# EAGLE design tiny85Digispark0805 (EAGLE 9.5.0)
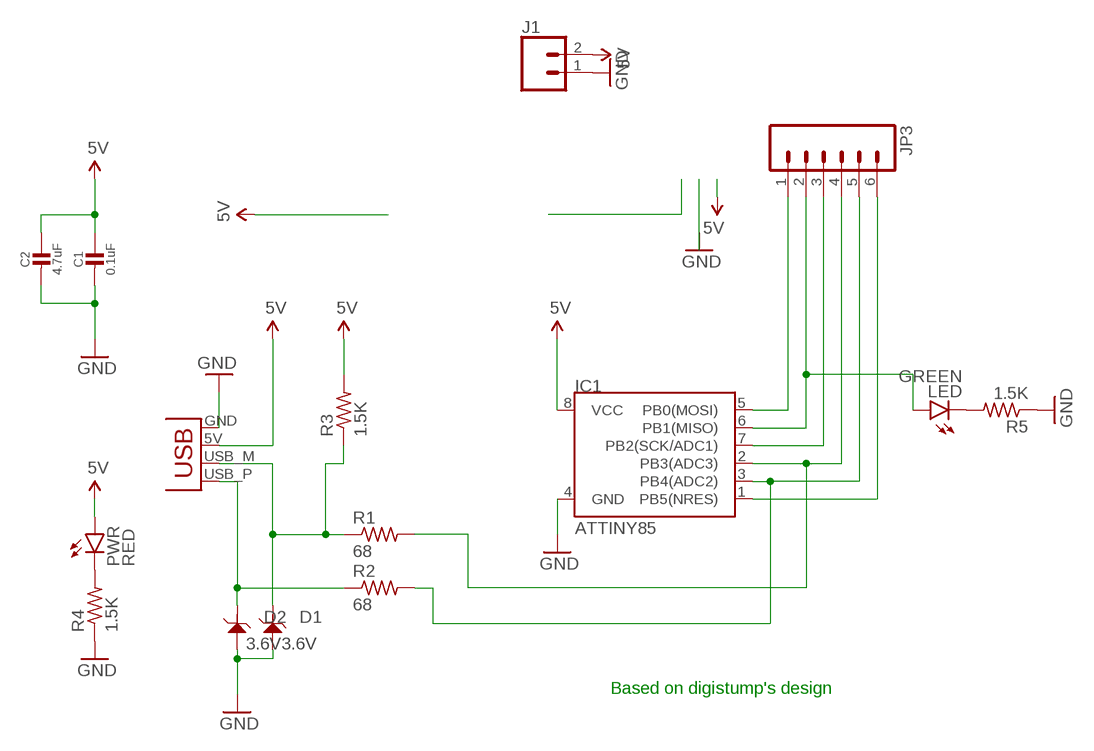
[diagram p0: schematic, sheet 1]

## Parts
C1  0.1uF  CAP_CERAMIC0805-NOOUTLINE  [0805-NO]
C2  4.7uF  CAP_CERAMIC0805-NOOUTLINE  [0805-NO]
D1  3.6V  SMD-DIODE-ESD-6.2V-250MW(SOD-123)  [SOD-123]
D2  3.6V  SMD-DIODE-ESD-6.2V-250MW(SOD-123)  [SOD-123]
IC1  ATTINY85  ATTINY45  [SO08-EIAJ]
J1  CONN_02  [1X02]
JP3  M06SIP  [1X06]
LED  GREEN  LEDCHIP-LED0805  [CHIP-LED0805]
PWR  RED  LEDCHIP-LED0805  [CHIP-LED0805]
R1  68  R-US_M0805  [M0805]
R2  68  R-US_M0805  [M0805]
R3  1.5K  R-US_M0805  [M0805]
R4  1.5K  R-US_M0805  [M0805]
R5  1.5K  R-US_M0805  [M0805]
X1  USBPCB  [USB-A-PCB]

## Nets
5V: C1.1 C2.1 IC1.8(VCC) J1.2 PWR.A R3.2 X1.5V(VBUS)
GND: C1.2 C2.2 D1.+ D2.+ IC1.4(GND) J1.1 R4.1 R5.1 X1.GND
N$1: PWR.C R4.2
N$2: LED.C R5.2
PB0: IC1.5(PB0(MOSI)) JP3.1
PB1: IC1.6(PB1(MISO)) JP3.2 LED.A
PB2: IC1.7(PB2(SCK/ADC1)) JP3.3
PB3: IC1.2(PB3(ADC3)) JP3.4 R1.2
PB4: IC1.3(PB4(ADC2)) JP3.5 R2.2
PB5: IC1.1(PB5(NRES)) JP3.6
USBM: D1.- R1.1 R3.1 X1.USB_M(D-)
USBP: D2.- R2.1 X1.USB_P(D+)

## Notes on the sheet
- Based on digistump's design

## Library data of the parts
C1 C2 = audio amplifier example:CAP_CERAMIC
D1 D2 = Seeed-Diode:SMD-DIODE-ESD-6.2V-250MW(SOD-123): 304060001; LCSC: C82565; MPN: CESD5V0D1; VALUE: CESD5V0D1
IC1 = SparkFun:ATTINY45: Atmel ATTiny45
J1 = SparkFun-Connectors:CONN_02: Multi connection point. Often used as Generic Header-pin footprint for 0.1 inch spaced/style header connections On any of the 0.1 inch spaced packages, you can populate with these: Break Away Headers - Straight <https://www.sparkfun.com/products/116> (PRT-00116) Break Away Male Headers - Right Angle <https://www.sparkfun.com/products/553> (PRT-00553) Female Headers <https://www.sparkfun.com/products/115> (PRT-00115) Break Away Headers - Machine Pin <https://www.sparkfun.com/products/117> (PRT-00117) Break Away Female Headers - Swiss Machine Pin <https://www.sparkfun.com/products/743> (PRT-00743) For SCREWTERMINALS and SPRING TERMINALS visit here: Screw Terimnals on SparkFun.com <https://www.sparkfun.com/search/results?term=Screw+Terminals> (5mm/3.5mm/2.54mm spacing) This device is also useful as a general connection point to wire up your design to another part of your project. Our various solder wires solder well into these plated through hole pads. Hook-Up Wire - Assortment (Stranded, 22 AWG) <https://www.sparkfun.com/products/11375> (PRT-11375) Hook-Up Wire - Assortment (Solid Core, 22 AWG) <https://www.sparkfun.com/products/11367> (PRT-11367) View the entire wire category on our website here <https://www.sparkfun.com/categories/141> Special notes: Molex polarized connector foot print use with: PRT-08233 with associated crimp pins and housings. 2.54_SCREWTERM for use with PRT-10571. 3.5mm Screw Terminal footprints for PRT-08084 5mm Screw Terminal footprints for use with PRT-08432
JP3 = SparkFun:M06: Header 6 Standard 6-pin 0.1" header. Use with straight break away headers (SKU : PRT-00116), right angle break away headers (PRT-00553), swiss pins (PRT-00743), machine pins (PRT-00117), and female headers (PRT-00115). Molex polarized connector foot print use with SKU : PRT-08094 with associated crimp pins and housings. NOTES ON THE VARIANTS LOCK and LOCK_LONGPADS... This footprint was designed to help hold the alignment of a through-hole component (i.e. 6-pin header) while soldering it into place. You may notice that each hole has been shifted either up or down by 0.005 of an inch from it's more standard position (which is a perfectly straight line). This slight alteration caused the pins (the squares in the middle) to touch the edges of the holes. Because they are alternating, it causes a "brace" to hold the component in place. 0.005 has proven to be the perfect amount of "off-center" position when using our standard breakaway headers. Although looks a little odd when you look at the bare footprint, once you have a header in there, the alteration is very hard to notice. Also, if you push a header all the way into place, it is covered up entirely on the bottom side. This idea of altering the position of holes to aid alignment will be further integrated into the Sparkfun Library for other footprints. It can help hold any component with 3 or more connection pins.
LED PWR = led:LED: LED OSRAM: - CHIPLED LG R971, LG N971, LY N971, LG Q971, LY Q971, LO R971, LY R971 LH N974, LH R974 LS Q976, LO Q976, LY Q976 LO Q996 - Hyper CHIPLED LW Q18S LB Q993, LB Q99A, LB R99A - SideLED LS A670, LO A670, LY A670, LG A670, LP A670 LB A673, LV A673, LT A673, LW A673 LH A674 LY A675 LS A676, LA A676, LO A676, LY A676, LW A676 LS A679, LY A679, LG A679 - Hyper Micro SIDELED® LS Y876, LA Y876, LO Y876, LY Y876 LT Y87S - SmartLED LW L88C, LW L88S LB L89C, LB L89S, LG L890 LS L89K, LO L89K, LY L89K LS L896, LA L896, LO L896, LY L896 - TOPLED LS T670, LO T670, LY T670, LG T670, LP T670 LSG T670, LSP T670, LSY T670, LOP T670, LYG T670 LG T671, LOG T671, LSG T671 LB T673, LV T673, LT T673, LW T673 LH T674 LS T676, LA T676, LO T676, LY T676, LB T676, LH T676, LSB T676, LW T676 LB T67C, LV T67C, LT T67C, LS T67K, LO T67K, LY T67K, LW E67C LS E67B, LA E67B, LO E67B, LY E67B, LB E67C, LV E67C, LT E67C LW T67C LS T679, LY T679, LG T679 LS T770, LO T770, LY T770, LG T770, LP T770 LB T773, LV T773, LT T773, LW T773 LH T774 LS E675, LA E675, LY E675, LS T675 LS T776, LA T776, LO T776, LY T776, LB T776 LHGB T686 LT T68C, LB T68C - Hyper Mini TOPLED® LB M676 - Mini TOPLED Santana® LG M470 LS M47K, LO M47K, LY M47K Source: http://www.osram.convergy.de LUXEON: - LUMILED® LXK2-PW12-R00, LXK2-PW12-S00, LXK2-PW14-U00, LXK2-PW14-V00 LXK2-PM12-R00, LXK2-PM12-S00, LXK2-PM14-U00 LXK2-PE12-Q00, LXK2-PE12-R00, LXK2-PE12-S00, LXK2-PE14-T00, LXK2-PE14-U00 LXK2-PB12-K00, LXK2-PB12-L00, LXK2-PB12-M00, LXK2-PB14-N00, LXK2-PB14-P00, LXK2-PB14-Q00 LXK2-PR12-L00, LXK2-PR12-M00, LXK2-PR14-Q00, LXK2-PR14-R00 LXK2-PD12-Q00, LXK2-PD12-R00, LXK2-PD12-S00 LXK2-PH12-R00, LXK2-PH12-S00 LXK2-PL12-P00, LXK2-PL12-Q00, LXK2-PL12-R00 Source: www.luxeon.com KINGBRIGHT: KA-3528ASYC Source: www.kingbright.com
R1-R5 = adafruit:R-US_: RESISTOR, American symbol
X1 = SparkFun:USB: USB Connectors USB-B-PTH is fully proven SKU : PRT-00139 USB-miniB is fully proven SKU : PRT-00587 USB-A-PCB is untested. USB-A-H is throughly reviewed, but untested. Spark Fun Electronics SKU : PRT-00437 USB-B-SMT is throughly reviewed, but untested. Needs silkscreen touching up. USB-A-S has not been used/tested USB-MB-H has not been used/tested

## Board
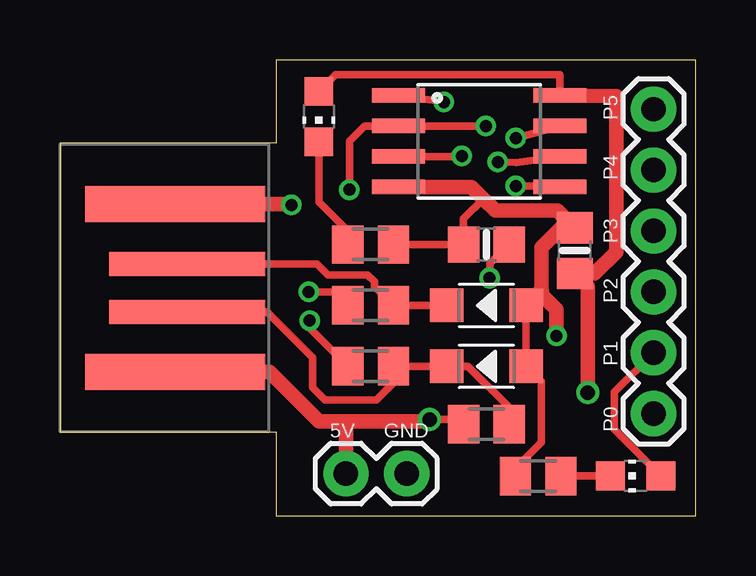
[diagram p1: board, top side]
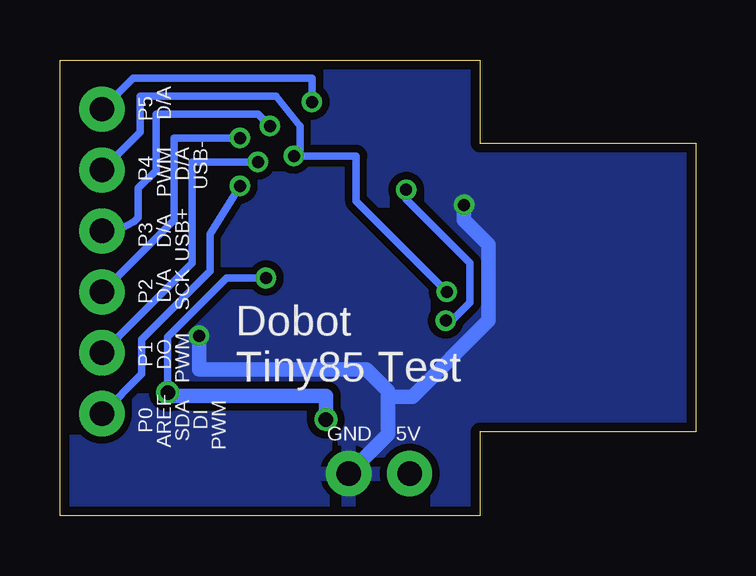
[diagram p2: board, bottom side, seen from below]

Size 26.5 x 19 mm. Coordinates in mm from the lower left corner, seen from the top.
Outline: 0,3.5 9,3.5 9,0 26.5,0 26.5,19 9,19 9,15.53 0,15.53 0,3.5
Copper layers (1*16): Top 0.0356mm / dielectric 1.5011mm / Bottom 0.0356mm
Design rules "default": minimum track width 8mil, minimum drill 13mil, track to track 12mil, track to pad 12mil, pad to pad 12mil, via to via 12mil, smd to smd 8mil, copper to edge 15mil, drill to drill 12mil, minimum pad ring 7mil, minimum via ring 7mil, stop-mask expansion 4mil, vias tented up to drill 25mil, thermal gap 10mil

### Footprints (pad centres in the part's own frame; a part is rotated, then mirrored left to right if it is on the bottom)
0805-NO = smd 1.3 x 1.5: 1 -0.95,0; 2 0.95,0
SOD-123 = smd 1.397 x 1.397: + -1.651,0; - 1.651,0
SO08-EIAJ = smd 0.61 x 2.21: 1 -1.905,-3.378; 2 -0.635,-3.378; 3 0.635,-3.378; 4 1.905,-3.378; 5 1.905,3.353; 6 0.635,3.353; 7 -0.635,3.353; 8 -1.905,3.353
1X02 = drill 1.016 pad 1.88: 1 0,0; 2 2.54,0
1X06 = drill 1.016 pad 1.88: 1 0,0; 2 2.54,0; 3 5.08,0; 4 7.62,0; 5 10.16,0; 6 12.7,0
CHIP-LED0805 = smd 1.2 x 1.2: A 0,-1.05; C 0,1.05
M0805 = smd 1.3 x 1.6: 1 -0.95,0; 2 0.95,0
USB-A-PCB = smd 7.5 x 1.5: 5V -0.2,-3.5; GND -0.2,3.5 | smd 6.5 x 1: USB_M 0.3,-1; USB_P 0.3,1

### Placement (x,y rotation side)
C1  21.46,11.05 90 top
C2  17.78,11.3 180 top
D1  17.78,6.22 180 top
D2  17.78,8.76 180 top
IC1  17.48,15.61 270 top
J1  14.46,1.75 180 top
JP3  24.75,4.25 90 top
LED  24,1.65 90 top
PWR  10.79,16.64 180 top
R1  12.95,6.22 180 top
R2  12.95,8.76 180 top
R3  17.78,3.81 180 top
R4  12.95,11.3 180 top
R5  19.94,1.65 0 top
X1  5,9.5 0 top

### Tracks (layer width: path | path; a pad name or v marks a point on that pad's centre or on a via)
5V  (via drill 0.5, 0.6)
  Top 0.305: IC1.8 20.84,18.38 11.48,18.38 PWR.A | v15.41,4 16.64,4 R3.2 | C2.1 17.94,10.51 17.94,9.94 v17.91,9.91
  Top 0.61: IC1.8 23.19,17.5 23.19,11 22.29,10.1 C1.1 22.01,9.55 v22.01,5.13 | v15.41,4 15.35,3.94 11.94,3.94 | X1.5V 8.73,6 10.79,3.94 11.94,3.94 | J1.2 11.92,3.92 11.94,3.94
  Bottom 0.305: v22.01,5.13 22.01,7.46 19.56,9.91 v17.91,9.91
  Bottom 0.61: v15.41,4 15.41,5 21.88,5 v22.01,5.13
GND  (via drill 0.5)
  Top 0.305: D2.+ D1.+ 20.07,5.59 20.07,3.05 18.99,1.97 R5.1 | R4.1 C2.2 16.83,12.38 17.65,13.21
  Top 0.61: IC1.4 17.16,13.71 17.65,13.21 18.15,12.71 20.75,12.71 C1.2 20.89,12 20.07,11.18 20.07,9.4 | 20.07,9.4 D2.+ | 20.07,9.4 20.1,9.36 20.1,9.2 20.7,8.6 v20.7,7.49 | X1.GND 9.61,13 v9.65,12.95
  Bottom 0.61: J1.1 12.83,3.38 12.83,4.95 | 12.83,4.95 12.83,5.21 13.72,6.1 20.7,6.1 v20.7,7.49 | v9.65,12.95 9.65,12.32 8.64,11.3 8.64,8.13 11.81,4.95 12.83,4.95
  pour Bottom: 0,3.43 5.59,3.43 9.02,0 26.42,0 26.42,18.92 9.02,18.92 5.71,15.62 0,15.62
N$1
  Top 0.305: PWR.C 10.79,13.08 12,11.87 R4.2
N$2
  Top 0.305: R5.2 LED.C
PB0  (via drill 0.5)
  Top 0.305: v19,13.75 20.79,13.75 IC1.5
  Bottom 0.305: v19,13.75 20.25,11.75 20.25,10.21 23.1,7.35 23.1,5.9 JP3.1
PB1  (via drill 0.5)
  Top 0.305: IC1.6 19.02,14.72 v18.25,14.75 | LED.A 23.11,3.59 23.11,5.15 JP3.2
  Bottom 0.305: v18.25,14.75 21,14.75 21,10.54 JP3.2
PB2  (via drill 0.5)
  Top 0.305: IC1.7 v19,15.74 v19,15.75
  Bottom 0.305: v19,15.75 21.75,15.75 21.75,12.33 JP3.3
PB3  (via drill 0.5)
  Top 0.305: 14.35,16.25 v17.75,16.25 | IC1.2 12.69,16.25 12.06,15.62 v12.06,13.59 | R1.2 10.41,7.81 v10.41,8.13
  Top 0.406: IC1.2 14.35,16.25
  Bottom 0.305: v17.75,16.25 18.25,16.75 22.5,16.75 22.5,14.39 23.24,13.65 23.24,12.43 23.41,12.26 24.13,11.87 JP3.4 | v12.06,13.59 12.06,13.21 9.4,10.54 9.4,8.89 10.16,8.13 v10.41,8.13
PB4  (via drill 0.5)
  Top 0.305: v16.75,15 16.48,14.97 IC1.3 | R2.2 11.44,9.33 v10.37,9.33
  Bottom 0.305: JP3.5 23.16,16 23.16,17.5 17.5,17.5 16.5,16.25 16.5,15.25 v16.75,15 14.15,15 14.15,13.11 v10.37,9.33
PB5  (via drill 0.5)
  Top 0.305: v16,17.25 15.98,17.27 IC1.1
  Bottom 0.305: JP3.6 23.45,18.25 16,18.25 v16,17.25
USBM
  Top 0.305: X1.USB_M 8.64,8.5 10.54,6.6 10.54,5.33 11.05,4.83 13.21,4.83 13.9,5.52 R1.1 D1.- 17.02,6.22 18.73,4.51 R3.1
USBP
  Top 0.305: D2.- R2.1 13.11,9.56 13.11,9.75 12.83,10.03 11.18,10.03 10.71,10.5 X1.USB_P

### Text on the board
bPlace: D/A | USB- | D/A | PWM | USB+ | D/A | SCK | D/A | PWM | DO | PWM | SDA | AREF | DI
tNames: P5 | P4 | P3 | P2 | P1 | P0 | 5V | GND
bNames: P5 | P4 | P3 | P2 | P1 | Dobot / Tiny85 Test | P0 | 5V | GND
Reference: The Digispark design (schematic, layout, concept) is licensed under the Creative Commons Attribution-ShareAlike 3.0 Unported License: http://creativecommons.org/licenses/by-sa/3.0/ | The Digispark and Digistump names and logos (or derivatives thereof) may not be used as part of the name of a product, company, or domain name without express written permission. | Digispark name. logo and Digistump name, logo Copyright 2013 Digistump LLC All Rights Reserved | For full details and license information please see http://digistump.com/wiki/digispark/policy | Created by Erik Kettenbugr, Digistump LLC - digistump.com 2012